# Altium schematic sheet 光笔.SchDoc
size A4
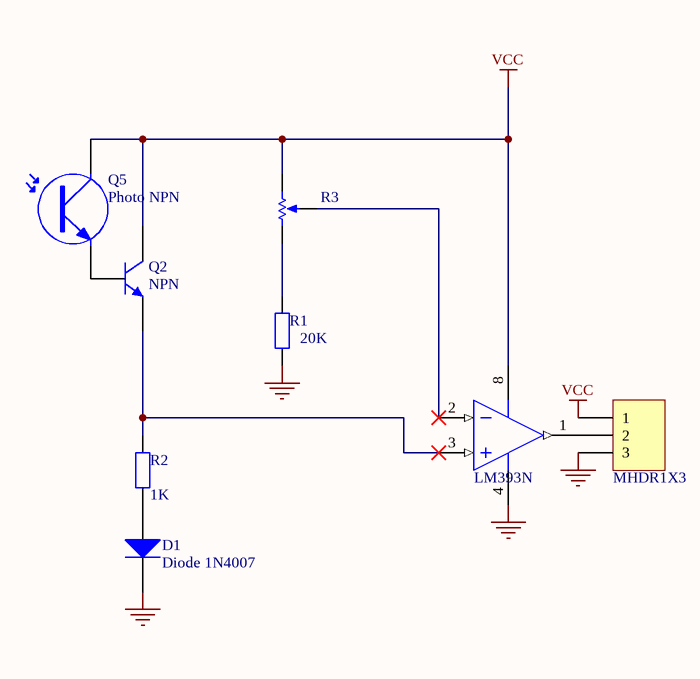
[diagram p0: 光笔.SchDoc]

## Parts
D1  Diode 1N4007  [DO-41]
P1  MHDR1X3  [MHDR1X3]
Q2  NPN  [TO-226]
Q5  Photo NPN  [TO-220_A]
R1  value 20K  [AXIAL-0.4]  (hidden comment: Res2)
R2  value 1K  [AXIAL-0.4]  (hidden comment: 1)
R3  电位器  [电位器]  (value not drawn)
U2  LM393N  [626-05]  (part A of 2)

## Nets
GND: D1.2(K) P1.3 R1.2 U2.4(GND)
VCC: P1.1 Q2.1(C) Q5.1(C) R3.2(BOT) U2.8(V+)
NetD1_1: D1.1(A) R2.2
NetP1_2: P1.2 U2.1(OUT)
NetQ2_2: Q2.2(B) Q5.3(E)
NetQ2_3: Q2.3(E) R2.1 U2.3(IN+)
NetR1_1: R1.1 R3.1
NetR3_3: R3.3(TAP) U2.2(IN-)

## Library data of the parts
D1 = Diode 1N4007: 1 Amp General Purpose Rectifier; Published: 8-Jun-2000; LatestRevisionDate: 17-Jul-2002; LatestRevisionNote: Re-released for DXP Platform.; DatasheetDocument: 1998; PackageDocument: Aug-1999; PackageReference: DO-41; Publisher: Altium Limited; Code_JEDEC: DO-204-AL; ComponentLink1Description: Manufacturer Link; ComponentLink1URL: http://www.fairchildsemi.com/; ComponentLink2Description: Datasheet; ComponentLink2URL: http://www.fairchildsemi.com/ds/1N%2F1N4001.pdf
P1 = MHDR1X3: Header, 3-Pin; LatestRevisionDate: 17-Jul-2002; LatestRevisionNote: Re-released for DXP Platform.; Publisher: Altium Limited
Q2 = NPN: NPN Bipolar Transistor; Published: 8-Jun-2000; LatestRevisionDate: 17-Jul-2002; LatestRevisionNote: Re-released for DXP Platform.; PackageReference: TO-226; Publisher: Altium Limited; Code_JEDEC: TO-226-AA
Q5 = Photo NPN: NPN Phototransistor; Published: 24-Mar-1999; LatestRevisionDate: 17-Jul-2002; LatestRevisionNote: Re-released for DXP Platform.; PackageReference: TO-220_A; Publisher: Altium Limited; Code_JEDEC: TO-220-AC
R1 R2 = Res2: Resistor; Published: 8-Jun-2000; LatestRevisionDate: 17-Jul-2002; LatestRevisionNote: Re-released for DXP Platform.; Publisher: Altium Limited
U2 = LM393N: Dual Comparator; Published: 17-Jul-2002; LatestRevisionDate: 06-Jun-2005; LatestRevisionNote: Stylized 3D Model Added.; DatasheetVersion: 1988; PackageReference: 626-05; Publisher: Altium Limited; PackageDescription: DIP; 8 Leads; Row Spacing 7.62 mm; Pitch 2.54 mm; ComponentLink1Description: Manufacturer Link; ComponentLink1URL: http://www.onsemi.com/site/products/taxonomy/0,4438,133,00.html